# Altium schematic sheet Dentist_camera_extender_schematic.SchDoc
size A3; SheetNumber: 1; SheetTotal: 2
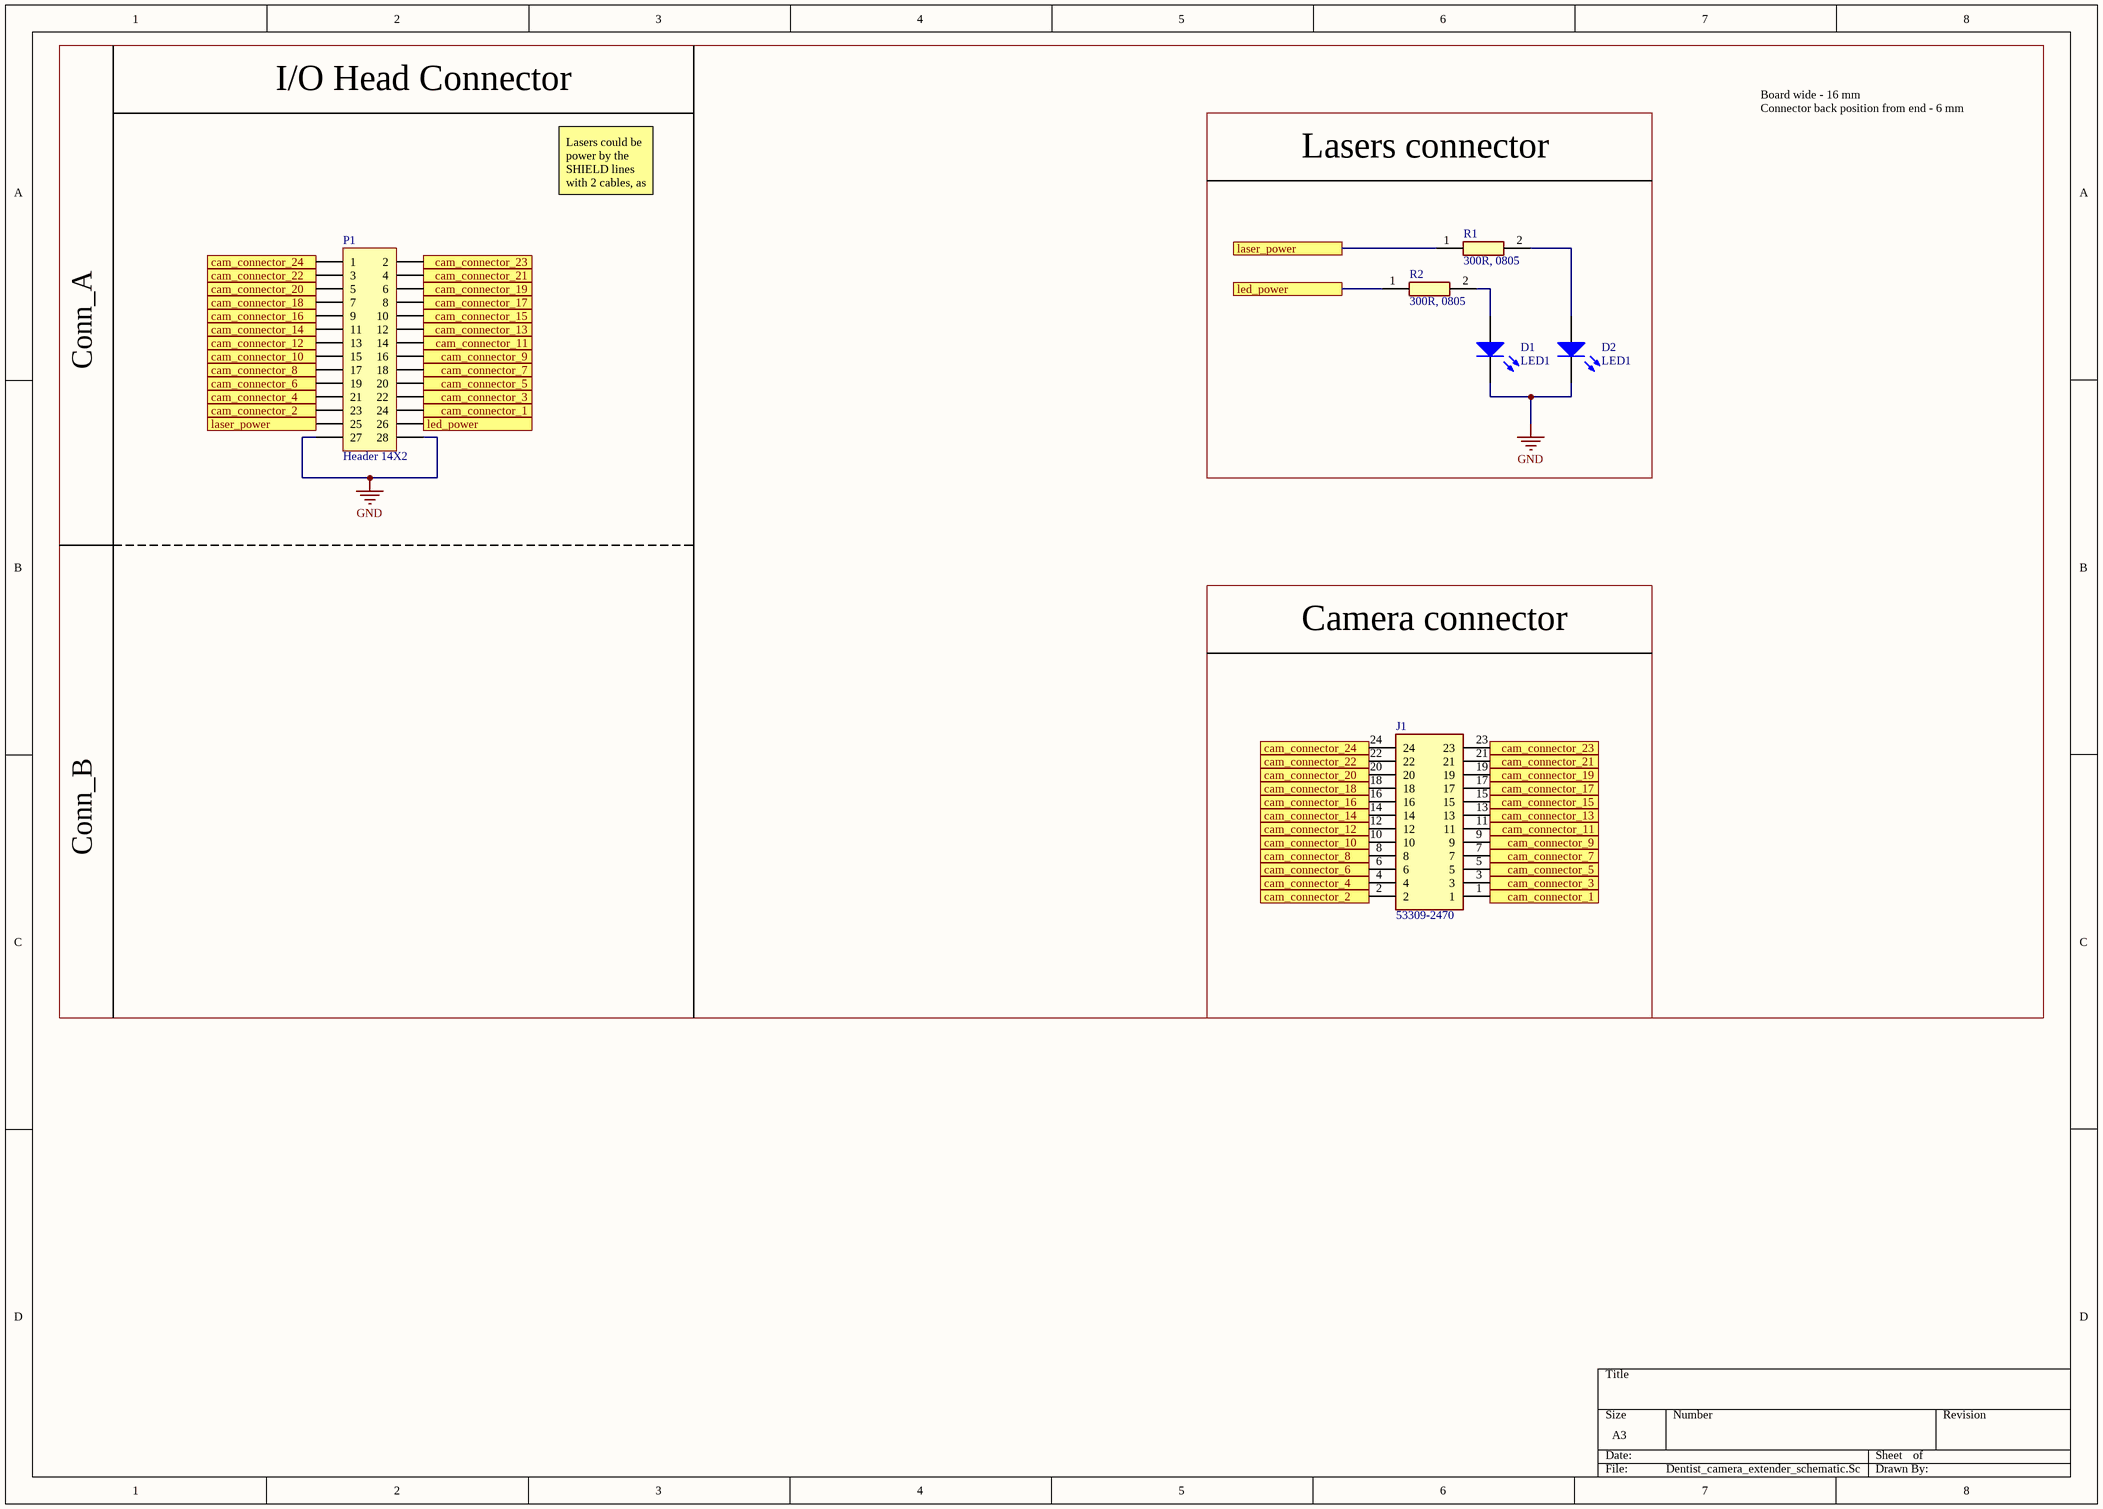
[diagram p0: Dentist_camera_extender_schematic.SchDoc]

## Parts
D1  LED1  [2_PIN_CONNECTOR]
D2  LED1  [2_PIN_CONNECTOR]
J1  53309-2470  [533092470]
P1  Header 14X2  [HDR2X14]
R1  300R, 0805  [RESC2012X65N]
R2  300R, 0805  [RESC2012X65N]

## Blocks framed on the sheet
I/O Head Connector: P1
Lasers connector: D1 D2 R1 R2
Camera connector: J1

## Ports
cam_connector_1, cam_connector_2, cam_connector_3, cam_connector_4, cam_connector_5, cam_connector_6, cam_connector_7, cam_connector_8, cam_connector_9, cam_connector_10, cam_connector_11, cam_connector_12, cam_connector_13, cam_connector_14, cam_connector_15, cam_connector_16, cam_connector_17, cam_connector_18, cam_connector_19, cam_connector_20, cam_connector_21, cam_connector_22, cam_connector_23, cam_connector_24, laser_power, led_power

## Nets
GND: D1.2(K) D2.2(K) P1.27 P1.28
cam_connector_1: J1.1 P1.24 ; port cam_connector_1
cam_connector_2: J1.2 P1.23 ; port cam_connector_2
cam_connector_3: J1.3 P1.22 ; port cam_connector_3
cam_connector_4: J1.4 P1.21 ; port cam_connector_4
cam_connector_5: J1.5 P1.20 ; port cam_connector_5
cam_connector_6: J1.6 P1.19 ; port cam_connector_6
cam_connector_7: J1.7 P1.18 ; port cam_connector_7
cam_connector_8: J1.8 P1.17 ; port cam_connector_8
cam_connector_9: J1.9 P1.16 ; port cam_connector_9
cam_connector_10: J1.10 P1.15 ; port cam_connector_10
cam_connector_11: J1.11 P1.14 ; port cam_connector_11
cam_connector_12: J1.12 P1.13 ; port cam_connector_12
cam_connector_13: J1.13 P1.12 ; port cam_connector_13
cam_connector_14: J1.14 P1.11 ; port cam_connector_14
cam_connector_15: J1.15 P1.10 ; port cam_connector_15
cam_connector_16: J1.16 P1.9 ; port cam_connector_16
cam_connector_17: J1.17 P1.8 ; port cam_connector_17
cam_connector_18: J1.18 P1.7 ; port cam_connector_18
cam_connector_19: J1.19 P1.6 ; port cam_connector_19
cam_connector_20: J1.20 P1.5 ; port cam_connector_20
cam_connector_21: J1.21 P1.4 ; port cam_connector_21
cam_connector_22: J1.22 P1.3 ; port cam_connector_22
cam_connector_23: J1.23 P1.2 ; port cam_connector_23
cam_connector_24: J1.24 P1.1 ; port cam_connector_24
laser_power: P1.25 R1.1 ; port laser_power
led_power: P1.26 R2.1 ; port led_power
NetD1_1: D1.1(A) R2.2
NetD2_1: D2.1(A) R1.2

## Notes on the sheet
- Board wide - 16 mm
  Connector back position from end - 6 mm
- Lasers could be power by the SHIELD lines with 2 cables, as L+ and GND
- Conn_A
- Conn_B

## Library data of the parts
D1 D2 = LED1: Typical RED GaAs LED; Published: 8-Jun-2000; LatestRevisionDate: 08-Jul-2005; LatestRevisionNote: Mech Layer 1 removed.; PackageReference: LED-1; Publisher: Altium Limited; PackageDescription: LED; 2 Leads
J1 = 53309-2470: Connector; Manufacturer_Name: Molex; Manufacturer_Part_Number: 53307-2471; Datasheet Link: https://www.mouser.com/datasheet/2/276/0533072471_PCB_HEADERS-146544.pdf; Height: 3.85mm; Mouser Part Number: 538-53307-2471; Mouser Price/Stock: https://www.mouser.co.uk/ProductDetail/Molex/53307-2471?qs=3DzawVMofg%252Bx9c%2FNm7UacA%3D%3D
P1 = Header 14X2: Header, 14-Pin, Dual row; LatestRevisionDate: 17-Jul-2002; LatestRevisionNote: Re-released for DXP Platform.; Publisher: Altium Limited
R1 R2 = CPF0805B100RE1: Resistor; Manufacturer_Name: TE Connectivity; Datasheet Link: http://docs-europe.electrocomponents.com/webdocs/13d1/0900766b813d116f.pdf; Height: 0.65mm; Manufacturer_Part_Number: CPF0805B100RE1; Mouser Part Number: 279-CPF0805B100RE1; Mouser Price/Stock: https://www.mouser.co.uk/ProductDetail/TE-Connectivity-Neohm/CPF0805B100RE1/?qs=9ylKvqdyudkCWLPT1QvLZQ%3D%3D; Arrow Part Number: CPF0805B100RE1; Arrow Price/Stock: https://www.arrow.com/en/products/cpf0805b100re1/te-connectivity